# EAGLE design door_light (EAGLE 6.4)
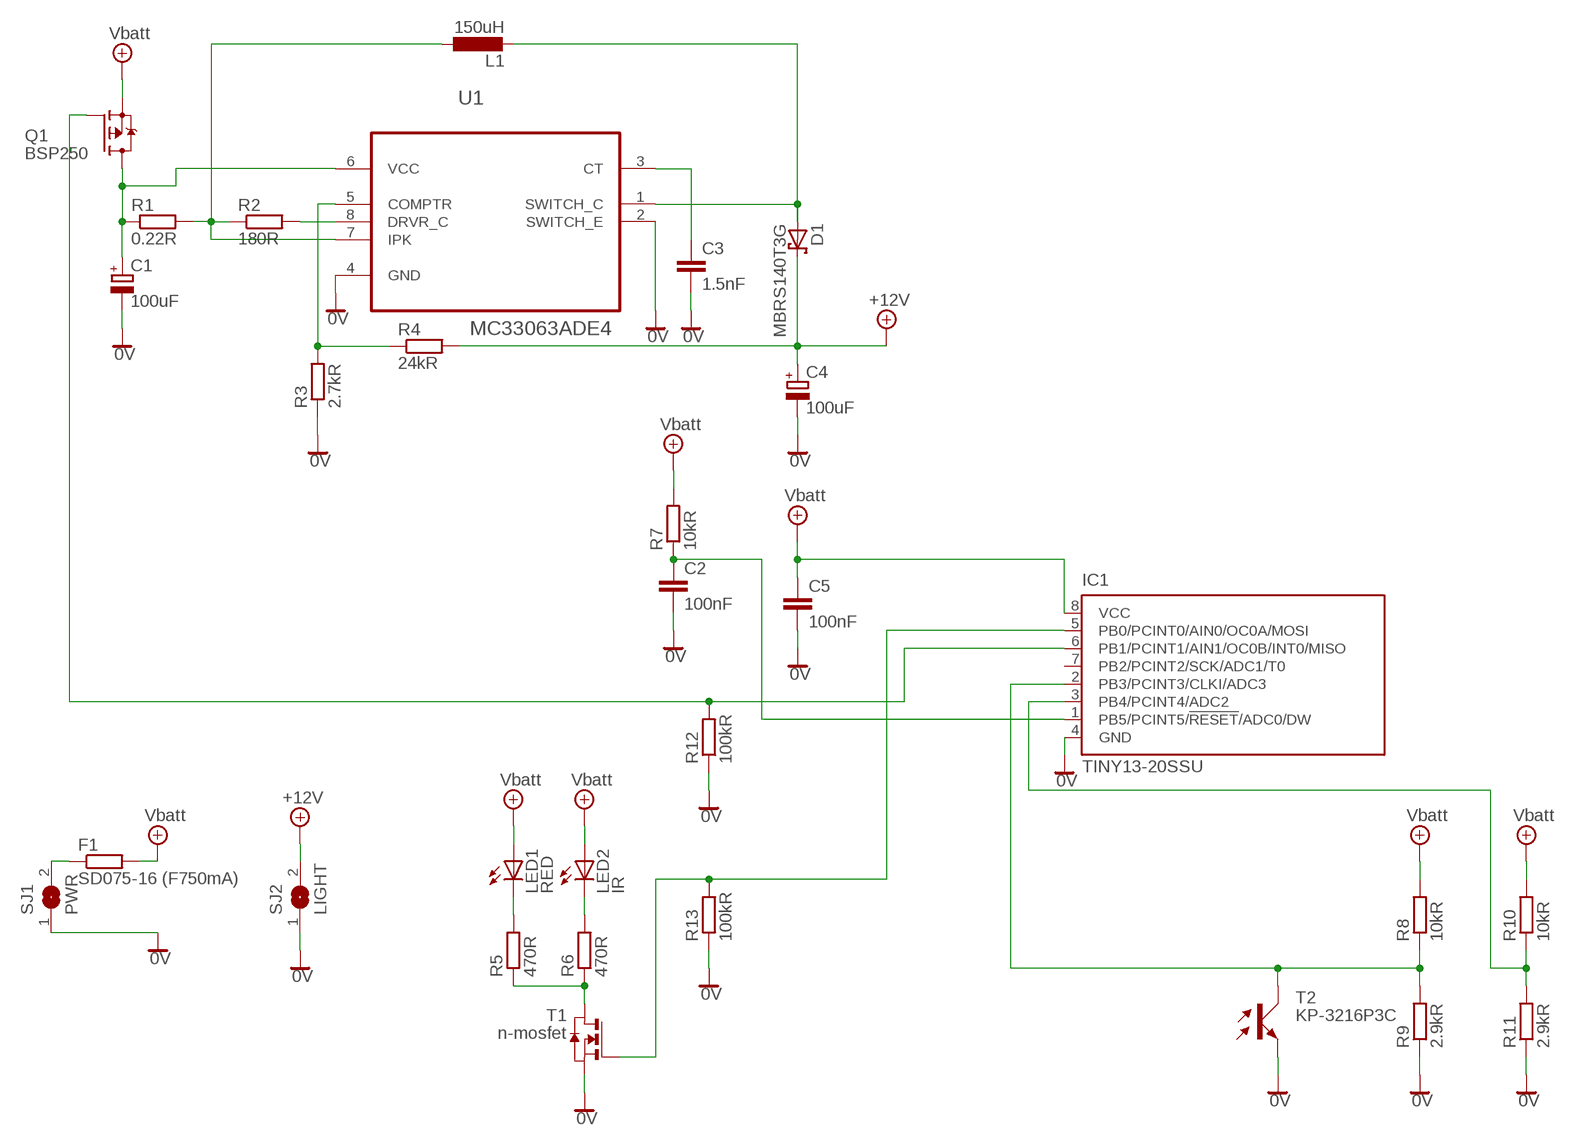
[diagram p0: schematic, sheet 1]

## Parts
C1  100uF  CPOL-EU153CLV-0810  [153CLV-0810]
C2  100nF  C-EUC1206  [C1206]
C3  1.5nF  C-EUC1206  [C1206]
C4  100uF  CPOL-EU153CLV-0810  [153CLV-0810]
C5  100nF  C-EUC1206  [C1206]
D1  MBRS140T3G  MBRS130LT3  [SMB]
F1  SD075-16 (F750mA)  R-EU_MELF0207W  [MINI_MELF-0207W]
IC1  TINY13-20SSU  [8S1]
L1  150uH  L-EUPIS2816  [PIS2816]
LED1  RED  LEDCHIPLED_0603  [CHIPLED_0603]
LED2  IR  LEDCHIPLED_1206  [CHIPLED_1206]
Q1  BSP250  BSP170P  [SOT223]
R1  0.22R  R-EU_M1206  [M1206]
R2  180R  R-EU_R0603  [R0603]
R3  2.7kR  R-EU_R0603  [R0603]
R4  24kR  R-EU_R0603  [R0603]
R5  470R  R-EU_R0603  [R0603]
R6  470R  R-EU_R0603  [R0603]
R7  10kR  R-EU_R0402  [R0402]
R8  10kR  R-EU_R0603  [R0603]
R9  2.9kR  R-EU_R0603  [R0603]
R10  10kR  R-EU_R0603  [R0603]
R11  2.9kR  R-EU_R0603  [R0603]
R12  100kR  R-EU_R0603  [R0603]
R13  100kR  R-EU_R0603  [R0603]
SJ1  PWR  SJW  [SJW]
SJ2  LIGHT  SJW  [SJW]
T1  n-mosfet  NMOSSOT23  [SOT-23]
T2  KP-3216P3C  [OPTO-TRANS-SIEMENS_BP103]
U1  MC33063ADE4  [SOIC127P600X175-8N]

## Nets
0V: C1.- C2.2 C3.2 C4.- C5.2 IC1.4(GND) R3.1 R9.1 R11.1 R12.1 R13.1 SJ1.1 SJ2.1 T1.2(S) T2.EMITER(E) U1.2(SWITCH_E) U1.4(GND)
+4.1V: C5.1 F1.2 IC1.8(VCC) LED1.A LED2.A Q1.3(S) R7.2 R8.2 R10.2 ; supply symbol labelled Vbatt
+12V: C4.+ D1.C R4.2 SJ2.2
N$1: LED1.C R5.2
N$2: LED2.C R6.2
N$3: C1.+ Q1.2(D) Q1.4(D) R1.1 U1.6(VCC)
N$4: R5.1 R6.1 T1.1(D)
N$8: F1.1 SJ1.2
N$9: C2.1 IC1.1(PB5/PCINT5/!RESET!/ADC0/DW) R7.1
N$10: C3.1 U1.3(CT)
N$11: D1.A L1.2 U1.1(SWITCH_C)
N$12: IC1.2(PB3/PCINT3/CLKI/ADC3) R8.1 R9.2 T2.COLLECTOR(C)
N$13: IC1.6(PB1/PCINT1/AIN1/OC0B/INT0/MISO) Q1.1(G) R12.2
N$14: IC1.5(PB0/PCINT0/AIN0/OC0A/MOSI) R13.2 T1.3(G)
N$15: R2.2 U1.8(DRVR_C)
N$16: L1.1 R1.2 R2.1 U1.7(IPK)
N$17: IC1.3(PB4/PCINT4/ADC2) R10.1 R11.2
N$18: R3.2 R4.1 U1.5(COMPTR)
Unconnected: IC1.7(PB2/PCINT2/SCK/ADC1/T0)

## Library data of the parts
C1 C4 = rcl:CPOL-EU: POLARIZED CAPACITOR, European symbol
C2 C3 C5 = rcl:C-EU: CAPACITOR, European symbol
D1 = diode:MBRS130LT3: Schottky Power Rectifier Source: http://www.onsemi.com/pub/Collateral/MBRS130LT3-D.PDF
F1 R1-R13 = rcl:R-EU_: RESISTOR, European symbol
IC1 = atmel:TINY13: 8-bit AVR Microcontroller with 1K Bytes In-System Programmable Flash Source: http://www.atmel.com/dyn/resources/prod_documents/2535S.pdf; MPN: ATTINY13-20SSU; OC_FARNELL: 1455133; OC_NEWARK: 58M3771
L1 = rcl:L-EU: INDUCTOR, European symbol
LED1 LED2 = led:LED: LED OSRAM: - CHIPLED LG R971, LG N971, LY N971, LG Q971, LY Q971, LO R971, LY R971 LH N974, LH R974 LS Q976, LO Q976, LY Q976 LO Q996 - Hyper CHIPLED LW Q18S LB Q993, LB Q99A, LB R99A - SideLED LS A670, LO A670, LY A670, LG A670, LP A670 LB A673, LV A673, LT A673, LW A673 LH A674 LY A675 LS A676, LA A676, LO A676, LY A676, LW A676 LS A679, LY A679, LG A679 - Hyper Micro SIDELED® LS Y876, LA Y876, LO Y876, LY Y876 LT Y87S - SmartLED LW L88C, LW L88S LB L89C, LB L89S, LG L890 LS L89K, LO L89K, LY L89K LS L896, LA L896, LO L896, LY L896 - TOPLED LS T670, LO T670, LY T670, LG T670, LP T670 LSG T670, LSP T670, LSY T670, LOP T670, LYG T670 LG T671, LOG T671, LSG T671 LB T673, LV T673, LT T673, LW T673 LH T674 LS T676, LA T676, LO T676, LY T676, LB T676, LH T676, LSB T676, LW T676 LB T67C, LV T67C, LT T67C, LS T67K, LO T67K, LY T67K, LW E67C LS E67B, LA E67B, LO E67B, LY E67B, LB E67C, LV E67C, LT E67C LW T67C LS T679, LY T679, LG T679 LS T770, LO T770, LY T770, LG T770, LP T770 LB T773, LV T773, LT T773, LW T773 LH T774 LS E675, LA E675, LY E675, LS T675 LS T776, LA T776, LO T776, LY T776, LB T776 LHGB T686 LT T68C, LB T68C - Hyper Mini TOPLED® LB M676 - Mini TOPLED Santana® LG M470 LS M47K, LO M47K, LY M47K Source: http://www.osram.convergy.de LUXEON: - LUMILED® LXK2-PW12-R00, LXK2-PW12-S00, LXK2-PW14-U00, LXK2-PW14-V00 LXK2-PM12-R00, LXK2-PM12-S00, LXK2-PM14-U00 LXK2-PE12-Q00, LXK2-PE12-R00, LXK2-PE12-S00, LXK2-PE14-T00, LXK2-PE14-U00 LXK2-PB12-K00, LXK2-PB12-L00, LXK2-PB12-M00, LXK2-PB14-N00, LXK2-PB14-P00, LXK2-PB14-Q00 LXK2-PR12-L00, LXK2-PR12-M00, LXK2-PR14-Q00, LXK2-PR14-R00 LXK2-PD12-Q00, LXK2-PD12-R00, LXK2-PD12-S00 LXK2-PH12-R00, LXK2-PH12-S00 LXK2-PL12-P00, LXK2-PL12-Q00, LXK2-PL12-R00 Source: www.luxeon.com KINGBRIGHT: KA-3528ASYC Source: www.kingbright.com
Q1 = transistor-fet:BSP170P: SIPMOS(R) Small-Signal-Transistor P-Channel, Enhancement mode Source: http://www.infineon.com/upload/Document/BSP170P_Rev2.4.pdf
SJ1 SJ2 = jumper:SJ: SMD solder JUMPER
T1 = zetex:NMOSSOT23: MOS FET; OC_FARNELL: unknown; OC_NEWARK: unknown
T2 = opto-trans-smd:KP-3216P3C: PHOTO TRANSISTOR KINGBRIGHT ELECTRONIC KP-3216P3C package: 1206 wave length: 940nm max. voltage: 30V view angle: 120° len: transparent; OC_FARNELL: unknown; OC_NEWARK: unknown
U1 = Texas Instruments_By_element14_Batch_1:MC33063ADE4: SWITCHING REGULATORS; MPN: MC33063ADE4; OC_FARNELL: 1053588; OC_NEWARK: 97K4656; PACKAGE: SOIC-8; SUPPLIER: TI

## Board
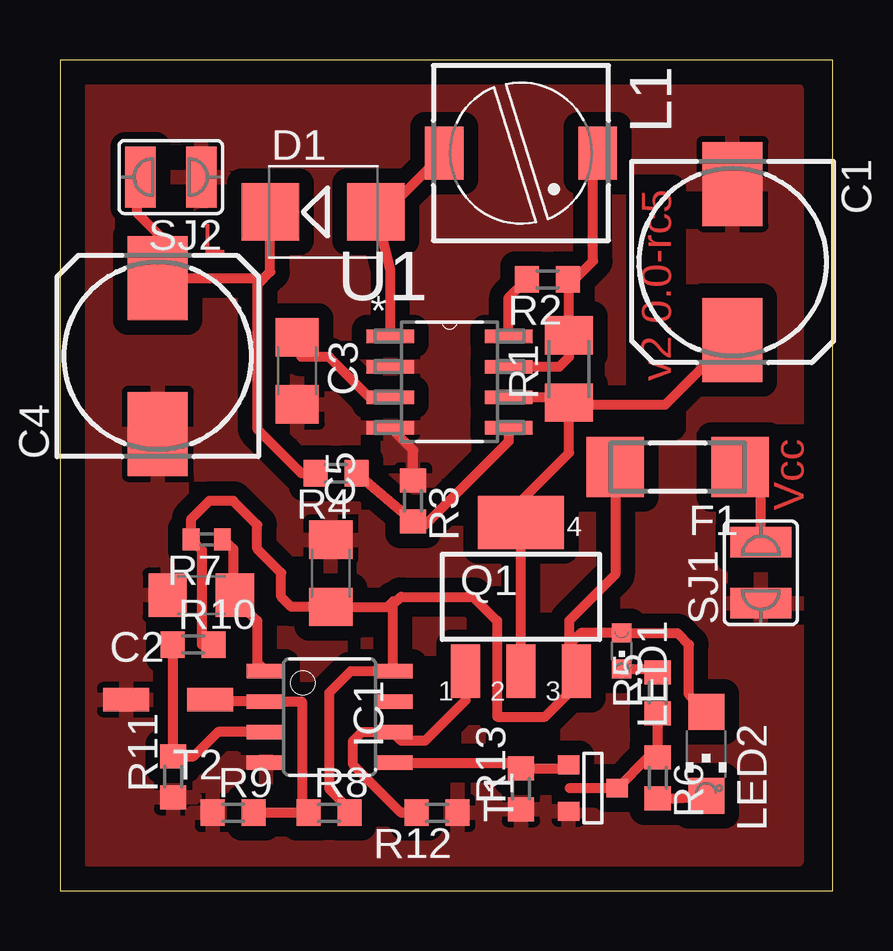
[diagram p1: board, top side]
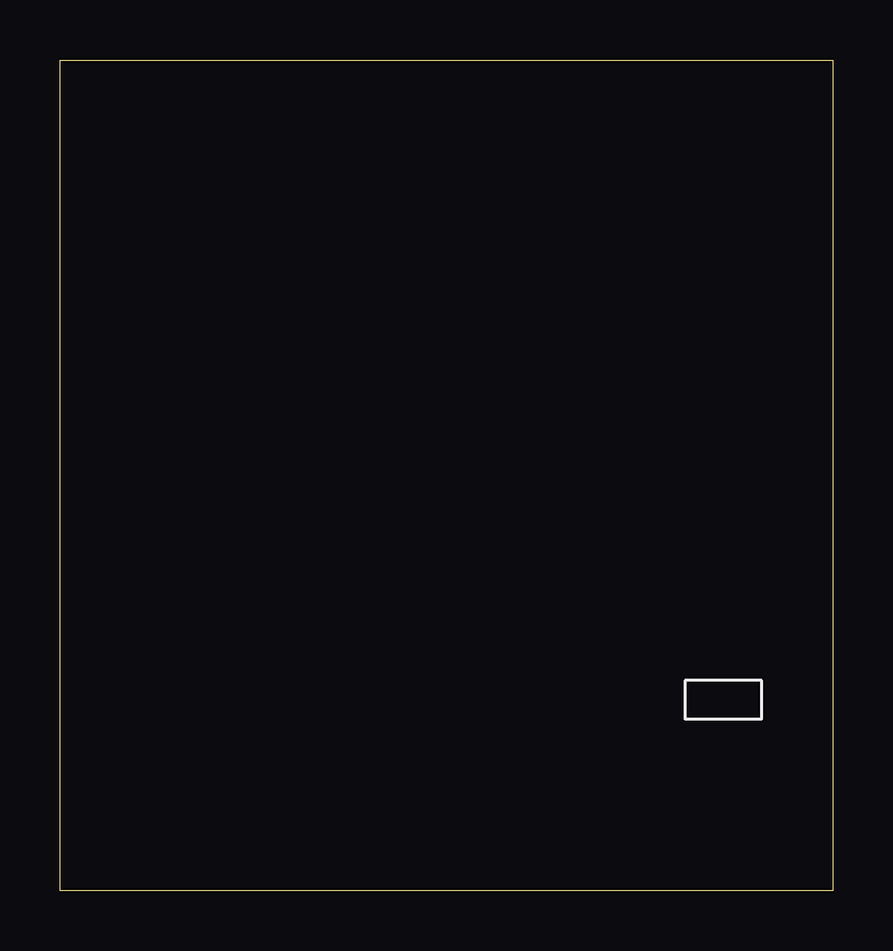
[diagram p2: board, bottom side, seen from below]

Size 32.22 x 34.63 mm. Coordinates in mm from the lower left corner, seen from the top.
Outline: 0,0 32.22,0 32.22,34.63 0,34.63 0,0
Copper layers (1*16): Top 0.035mm / dielectric 1.5mm / Bottom 0.035mm
Design rules "default": minimum track width 10mil, minimum drill 24mil, track to track 8mil, track to pad 8mil, pad to pad 8mil, via to via 8mil, smd to smd 8mil, copper to edge 40mil, drill to drill 8mil, minimum pad ring 10mil, minimum via ring 8mil, stop-mask expansion 4mil, vias tented up to drill 0mil, thermal gap 10mil

### Footprints (pad centres in the part's own frame; a part is rotated, then mirrored left to right if it is on the bottom)
153CLV-0810 = smd 3.5 x 2.5: + 3.25,0; - -3.25,0
C1206 = smd 1.6 x 1.8: 1 -1.4,0; 2 1.4,0
SMB = smd 2.4 x 2.4: A 2.2,0; C -2.2,0
MINI_MELF-0207W = smd 2.4 x 2.5: 1 -2.6,0; 2 2.6,0
8S1 = smd 0.6 x 1.6: 1 -1.905,-2.654; 2 -0.645,-2.654; 3 0.625,-2.654; 4 1.895,-2.654; 5 1.905,2.654; 6 0.635,2.654; 7 -0.635,2.654; 8 -1.905,2.654
PIS2816 = smd 2.2 x 1.6: 1 0,3.2; 2 0,-3.2
CHIPLED_0603 = smd 0.8 x 0.8: A 0,-0.75; C 0,0.75
CHIPLED_1206 = smd 1.5 x 1.5: A 0,-1.75; C 0,1.75
SOT223 = smd 1.219 x 2.235: 1 -2.311,-3.099; 2 0,-3.099; 3 2.311,-3.099 | smd 3.6 x 2.2: 4 0,3.099
M1206 = smd 1.6 x 2: 1 -1.4,0; 2 1.4,0
R0603 = smd 1 x 1.1: 1 -0.85,0; 2 0.85,0
R0402 = smd 0.7 x 0.9: 1 -0.65,0; 2 0.65,0
SJW = smd 1.27 x 2.54: 1 -1.27,0; 2 1.27,0
SOT-23 = smd 0.787 x 0.889: 1 0.025,-1.016; 2 -0.94,1.016; 3 0.991,1.016
OPTO-TRANS-SIEMENS_BP103 = smd 1.93 x 0.965: COLLECTOR -1.37,0.47; EMITER 2.13,0.47
SOIC127P600X175-8N = smd 1.981 x 0.559: 1 -2.464,1.905; 2 -2.464,0.635; 3 -2.464,-0.635; 4 -2.464,-1.905; 5 2.464,-1.905; 6 2.464,-0.635; 7 2.464,0.635; 8 2.464,1.905

### Placement (x,y rotation side)
C1  28.04,26.21 270 top
C2  5.89,12.32 180 top
C3  9.89,21.67 270 top
C4  4.08,22.29 90 top
C5  11.29,13.23 90 top
D1  10.97,28.29 0 top
F1  25.75,17.66 180 top
IC1  11.24,7.24 270 top
L1  19.22,30.75 270 top
LED1  23.42,9.99 180 top
LED2  26.94,5.7 180 top
Q1  19.22,12.25 0 top
R1  21.22,21.75 90 top
R2  20.32,25.48 180 top
R3  14.72,16.25 270 top
R4  11.51,17.4 180 top
R5  24.92,8.25 90 top
R6  24.92,4.7 270 top
R7  6.12,14.64 180 top
R8  11.22,3.25 0 top
R9  7.22,3.25 0 top
R10  5.55,10.26 0 top
R11  4.72,4.75 90 top
R12  15.72,3.25 180 top
R13  19.22,4.25 90 top
SJ1  29.22,13.25 90 top
SJ2  4.62,29.75 180 top
T1  22.22,4.25 90 top
T2  4.89,8.43 180 top
U1  16.24,21.21 0 top

### Tracks (layer width: path | path; a pad name or v marks a point on that pad's centre or on a via)
0V
  Top 0.406: R3.1 14.72,18.36 U1.4
  pour Top (isolate 0.61): 1.27,1.27 1.27,33.37 30.72,33.37 30.72,1.27
+4.1V
  Top 0.406: IC1.8 13.89,12.07 13.66,11.83 C5.1 9.64,11.83 9.22,12.25 9.22,13.25 8.22,14.25 8.22,15.25 7.22,16.25 6.22,16.25 5.47,15.5 R7.2 5.92,14.19 5.92,10.25 6.4,10.07 R10.2 | F1.2 23.15,13.18 21.22,11.25 21.22,10.25 | 21.22,10.25 21.22,9.46 Q1.3 21.22,8.84 21.22,8.25 20.22,7.25 18.22,7.25 18.22,11.25 17.22,12.25 14.22,12.25 13.89,11.92 IC1.8 | 21.22,10.25 21.71,10.74 LED1.A 25.73,10.74 26.22,10.25 26.22,8.17 LED2.A | R8.2 12.07,3.4 11.22,4.25 11.22,8.25 12.11,9.15 IC1.8
+12V
  Top 0.406: 8.22,25.25 8.77,25.8 D1.C | 8.22,25.25 8.22,19.25 10.07,17.4 R4.2 | 8.22,25.25 8.22,25.54 C4.+ 4.08,27.39 3.22,28.25 3.22,29.62 SJ2.2
N$1
  Top 0.406: LED1.C 24.78,9.24 R5.2
N$2
  Top 0.406: R6.2 25.74,3.85 LED2.C
N$3
  Top 0.406: R1.1 21.22,18.25 19.22,16.25 Q1.4 Q1.2 | C1.+ 27.93,22.96 25.22,20.25 21.32,20.25 R1.1 | U1.6 20.99,20.58 R1.1
N$4
  Top 0.406: 21.24,4.27 T1.1 24.51,5.55 R6.1 R5.1
N$8
  Top 0.406: 28.81,17.2 F1.1 28.35,17.25 29.22,17.25 SJ1.2
N$9
  Top 0.406: 7.61,12.64 C2.1 | C2.1 7.29,12.18 8.22,11.25 8.22,9.51 IC1.1 | R7.1 6.83,14.64 7.22,14.25 7.22,12.39 C2.1
N$10
  Top 0.406: U1.3 12.89,20.58 11.22,22.25 10.07,22.25 C3.1
N$11
  Top 0.406: U1.1 13.78,25.9 D1.A 13.56,28.29 L1.2
N$12
  Top 0.406: T2.COLLECTOR 7.18,7.88 IC1.2 10.08,7.88 10.08,3.53 R8.1 R9.2
N$13
  Top 0.406: Q1.1 16.91,7.94 15.22,6.25 14.22,6.25 IC1.6 12.57,6.6 12.22,6.25 12.22,5.25 14.22,3.25 R12.2
N$14
  Top 0.406: IC1.5 18.98,5.34 R13.2 21.06,5.1 T1.3
N$15
  Top 0.406: U1.8 18.7,24.71 R2.2
N$16
  Top 0.406: U1.7 20.81,21.84 21.22,22.25 R1.2 21.22,25.43 R2.1 21.45,25.48 22.22,26.25 22.22,30.55 L1.1
N$17
  Top 0.406: R10.1 4.7,5.62 R11.2 5.57,5.6 6.58,6.62 IC1.3
N$18
  Top 0.406: U1.5 18.7,18.73 15.22,15.25 14.87,15.25 R3.2 R4.1

### Text on the board
Top: v2.0.0-rc5 | L | Vcc